# EAGLE schematic HCSR04 (EAGLE 8.7.0)
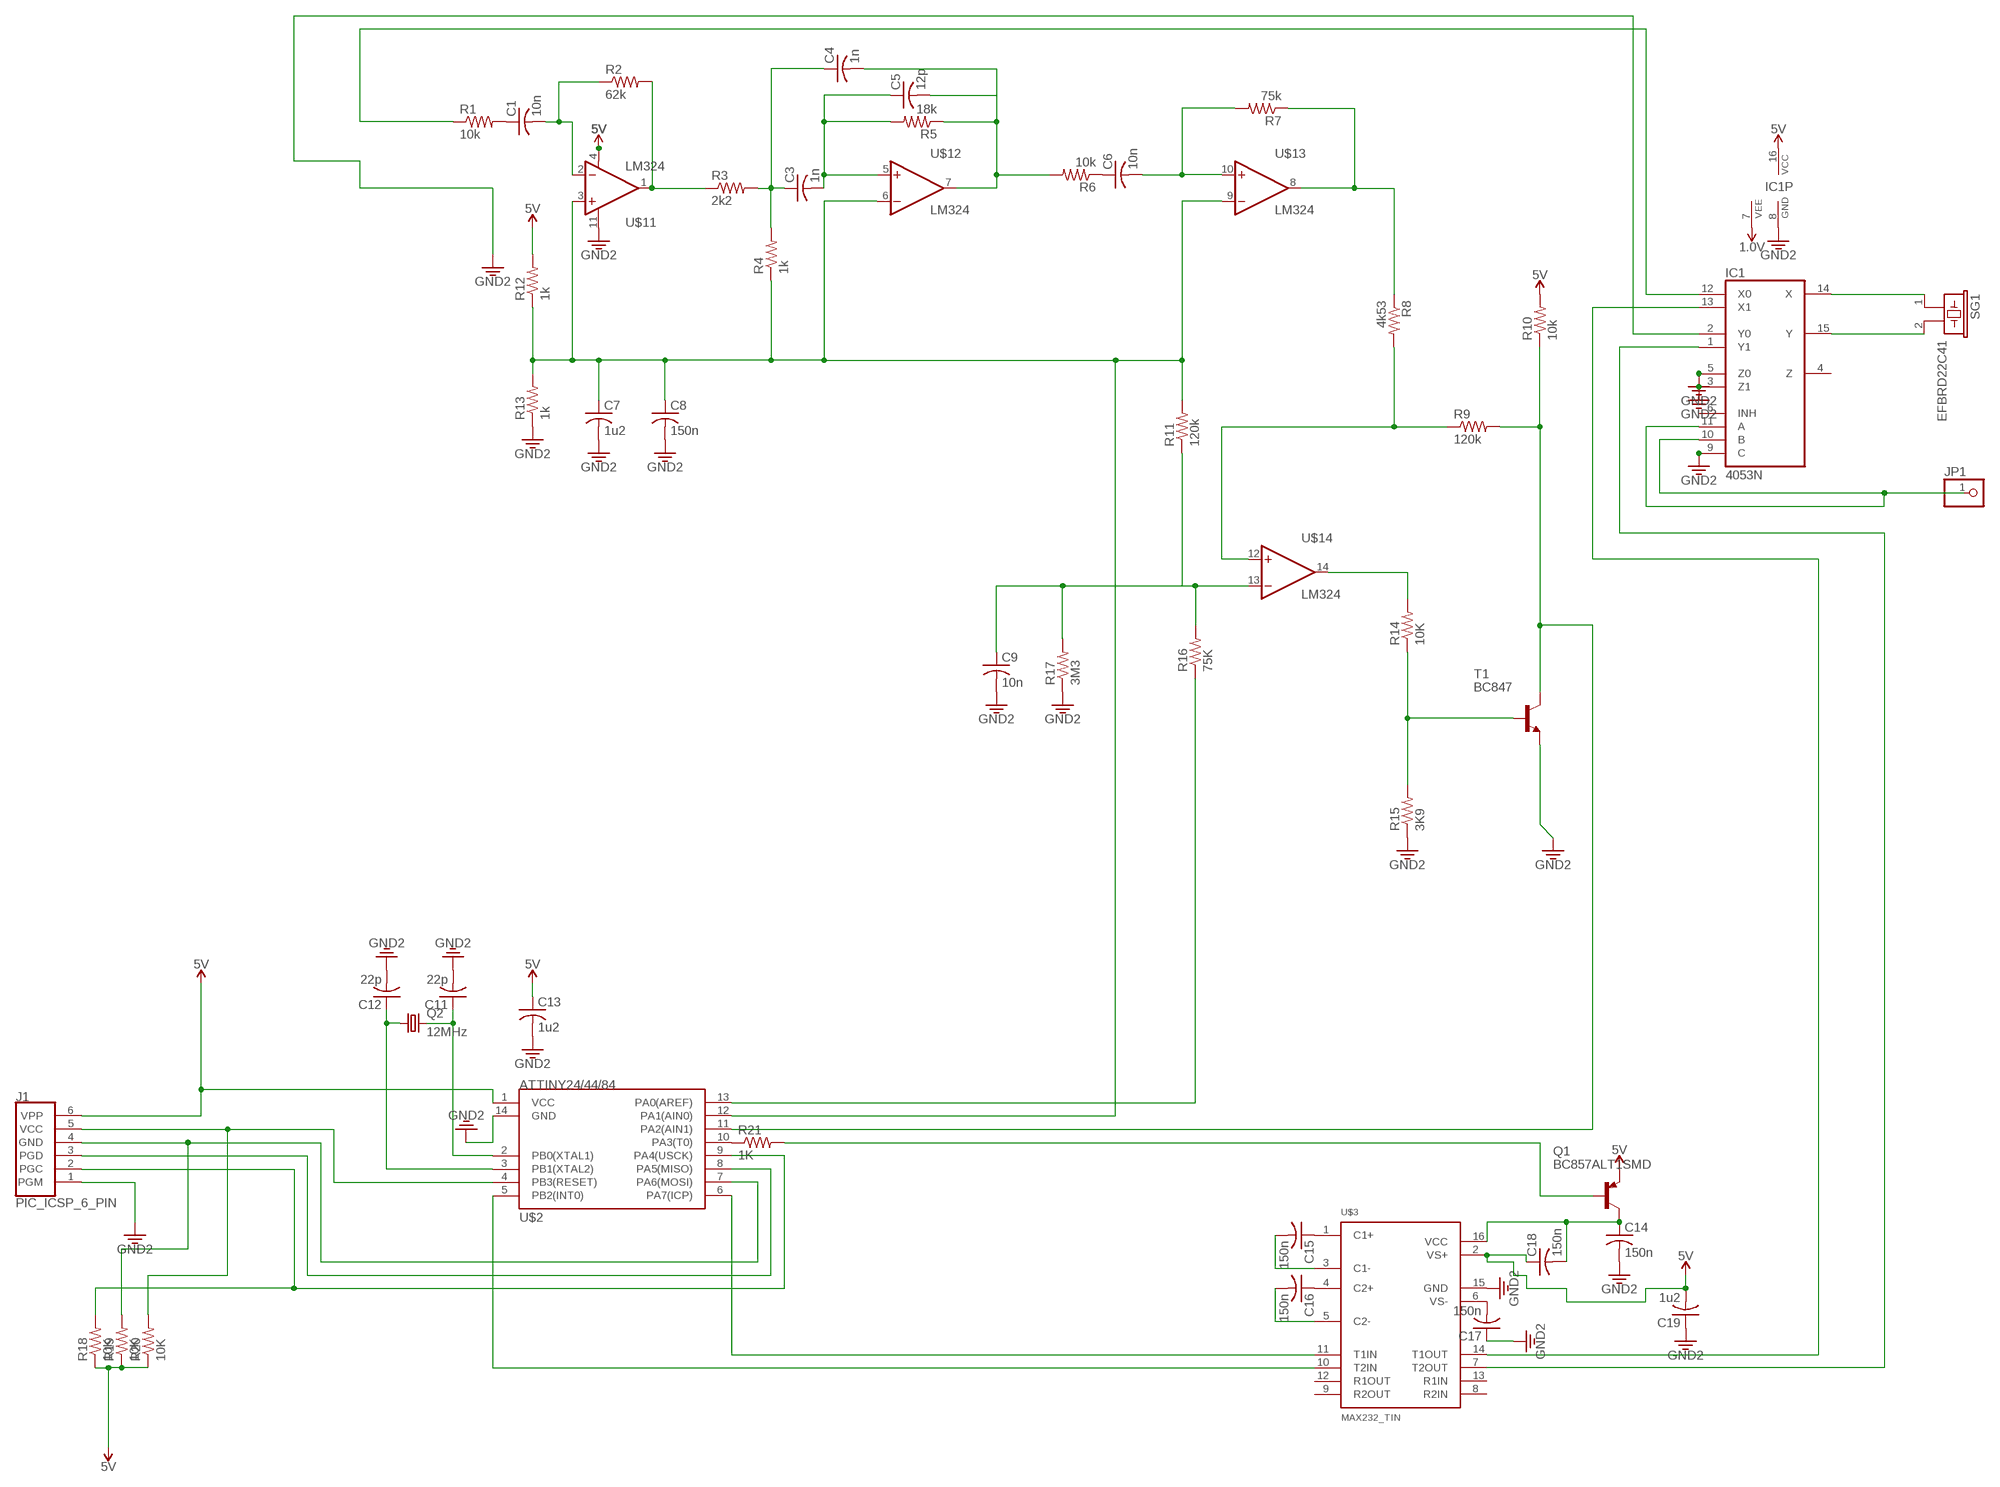
[diagram p0: schematic, sheet 1]

## Parts
C1  10n  C-US025-024X044  [C025-024X044]
C3  1n  C-US050-050X075  [C050-050X075]
C4  1n  C-US050-050X075  [C050-050X075]
C5  12p  C-US050-050X075  [C050-050X075]
C6  10n  C-US050-050X075  [C050-050X075]
C7  1u2  C-US050-050X075  [C050-050X075]
C8  150n  C-US050-050X075  [C050-050X075]
C9  10n  C-US025-024X044  [C025-024X044]
C11  22p  C-US025-024X044  [C025-024X044]
C12  22p  C-US025-024X044  [C025-024X044]
C13  1u2  C-US025-025X050  [C025-025X050]
C14  150n  C-US025-024X044  [C025-024X044]
C15  150n  C-US025-024X044  [C025-024X044]
C16  150n  C-US025-024X044  [C025-024X044]
C17  150n  C-US025-024X044  [C025-024X044]
C18  150n  C-US025-024X044  [C025-024X044]
C19  1u2  C-US025-024X044  [C025-024X044]
IC1  4053N  [DIL16]
J1  PIC_ICSP_6_PIN  [MOLEX-1X6]
JP1  PINHD-1X1  [1X01]
Q1  BC857ALT1SMD  [SOT23-BEC]
Q2  12MHz  CRYSTALHC33U-V  [HC33U-V]
R1  10k  FLIPFLOP-RES  [0805-THM]
R2  62k  FLIPFLOP-RES  [0805-THM]
R3  2k2  FLIPFLOP-RES  [0805-THM]
R4  1k  FLIPFLOP-RES  [0805-THM]
R5  18k  FLIPFLOP-RES  [0805-THM]
R6  10k  FLIPFLOP-RES  [0805-THM]
R7  75k  FLIPFLOP-RES  [0805-THM]
R8  4k53  FLIPFLOP-RES  [0805-THM]
R9  120k  FLIPFLOP-RES  [0805-THM]
R10  10k  FLIPFLOP-RES  [0805-THM]
R11  120k  FLIPFLOP-RES  [0805-THM]
R12  1k  FLIPFLOP-RES  [0805-THM]
R13  1k  FLIPFLOP-RES  [0805-THM]
R14  10K  R-US_0204/7  [0204/7]
R15  3K9  R-US_0204/7  [0204/7]
R16  75K  R-US_0204/7  [0204/7]
R17  3M3  R-US_0204/7  [0204/7]
R18  10K  R-US_0204/5  [0204/5]
R19  10K  R-US_0204/5  [0204/5]
R20  10K  R-US_0204/5  [0204/5]
R21  1K  R-US_0204/2V  [0204V]
SG1  EFBRD22C41  [EFBRD22C41]
T1  BC847  [SOT23]
U$1  LM324  [SOIC-14]
U$2  ATTINY24  [SOIC-14]
U$3  MAX232_TIN  [DIL16]

## Nets
1.0V: IC1.7(VEE)
3.3V: C7.2 C8.2 C9.2 C11.2 C12.2 C13.2 C14.2 C17.1 C19.1 IC1.2(Y0) IC1.8(GND) J1.1(PGM) R13.1 R15.1 R17.1 T1.2(E) U$1.11(1:V-) U$2.14(GND) U$3.15(GND) ; supply symbol labelled GND2
5V: C13.1 C18.1 C19.2 IC1.16(VCC) J1.6(VPP) Q1.E R10.2 R12.2 R18.1 R19.1 R20.1 U$1.4(1:V+) U$2.1(VCC) U$3.2(VS+)
N$1: C1.1 R1.2
N$2: C1.2 R2.1 U$1.2(1:-IN)
N$3: R2.2 R3.1 U$1.1(1:OUT)
N$4: C3.1 C4.1 R3.2 R4.2
N$5: C3.2 C5.1 R5.2 U$1.5(2:+IN)
N$6: C4.2 C5.2 R5.1 R6.2 U$1.7(2:OUT)
N$7: C6.2 R7.2 U$1.10(3:+IN)
N$8: C6.1 R6.1
N$9: R7.1 R8.1 U$1.8(3:OUT)
N$10: R8.2 R9.1 U$1.12(4:+IN)
N$11: R9.2 R10.1 T1.3(C) U$2.11(PA2(AIN1))
N$12: R21.1 U$2.10(PA3(T0))
N$13: C7.1 C8.1 R4.1 R11.2 R12.1 R13.2 U$1.3(1:+IN) U$1.6(2:-IN) U$1.9(3:-IN) U$2.12(PA1(AIN0))
N$14: J1.5(VCC) R20.2 U$2.4(PB3(RESET))
N$15: IC1.1(Y1) U$3.7(T2OUT)
N$16: C9.1 R11.1 R16.2 R17.2 U$1.13(4:-IN)
N$17: J1.4(GND) R19.2 U$2.7(PA6(MOSI))
N$18: R14.2 U$1.14(4:OUT)
N$19: R14.1 R15.2 T1.1(B)
N$20: J1.3(PGD) U$2.8(PA5(MISO))
N$21: J1.2(PGC) R18.2 U$2.9(PA4(USCK))
N$22: C15.1 U$3.1(C1+)
N$23: C11.1 Q2.2 U$2.2(PB0(XTAL1))
N$24: C12.1 Q2.1 U$2.3(PB1(XTAL2))
N$25: R16.1 U$2.13(PA0(AREF))
N$26: C16.1 U$3.4(C2+)
N$27: C17.2 U$3.6(VS-)
N$28: C14.1 C18.2 Q1.C U$3.16(VCC)
N$29: C15.2 U$3.3(C1-)
N$30: C16.2 U$3.5(C2-)
N$31: Q1.B R21.2
N$32: IC1.12(X0) R1.1
N$33: U$2.6(PA7(ICP)) U$3.11(T1IN)
N$34: U$2.5(PB2(INT0)) U$3.10(T2IN)
N$35: IC1.14(X) SG1.1
N$36: IC1.13(X1) U$3.14(T1OUT)
N$37: IC1.15(Y) SG1.2
N$38: IC1.10(B) IC1.11(A) JP1.1
Unconnected: IC1.3(Z1) IC1.4(Z) IC1.5(Z0) IC1.6(INH) IC1.9(C) U$3.8(R2IN) U$3.9(R2OUT) U$3.12(R1OUT) U$3.13(R1IN)

## Library data of the parts
C1 C3-C9 C11-C19 = adafruit:C-US: CAPACITOR, American symbol
IC1 = 40xx:4053: Triple 2-channel ANALOG MULTIPLEXER
J1 = SparkFun-Connectors:PIC_ICSP_6_PIN: ISCP Programming connector for PICs This 6 pin header contains all the lines necessary for programming most PIC microcontrollers. Here is the connector we sell at SparkFun: Polarized Connectors - Header (6-Pin) <https://www.sparkfun.com/products/8094> (PRT-08094) It is used on this SparkFun product: SparkFun UDB5 - PIC UAV Development Board <https://www.sparkfun.com/products/11703> (DEV-11703) Also, if you need a nice PIC programmer, please check these out: MPLAB PICkit 3 <https://www.sparkfun.com/products/9973> (PGM-09973); PROD_ID: CONN-08046; SF_ID: PRT-08094
JP1 = adafruit:PINHD-1X1: Pin header 1x1 for 0.1" spacing With round pins
Q1 = transistor-pnp:BC857*: PNP Transistror
Q2 = crystal:CRYSTAL: CRYSTAL; OC_FARNELL: unknown; OC_NEWARK: unknown
R1-R13 = adafruit:FLIPFLOP-RES: Flip Flop resistor An 0805 resistor inside a standard 1/4W 5% resistor. Makes for easy mods
R14-R21 = adafruit:R-US_: RESISTOR, American symbol
SG1 = buzzer:EFB?: Piezoelectric Acoustic Transducer Source: Panbasonic .. 2SC1685.pdf; OC_FARNELL: unknown; OC_NEWARK: unknown
T1 = transistor:BC847: NPN TRANSISTOR
U$1 = seanvoisen:LM324: LM324 Quad Op-amp
U$2 = seanvoisen:ATTINY24: Atmel ATtiny24/44/84 Microcontroller
U$3 = max232ti_n:MAX232_TI: MAX232, Texas Instruments Version